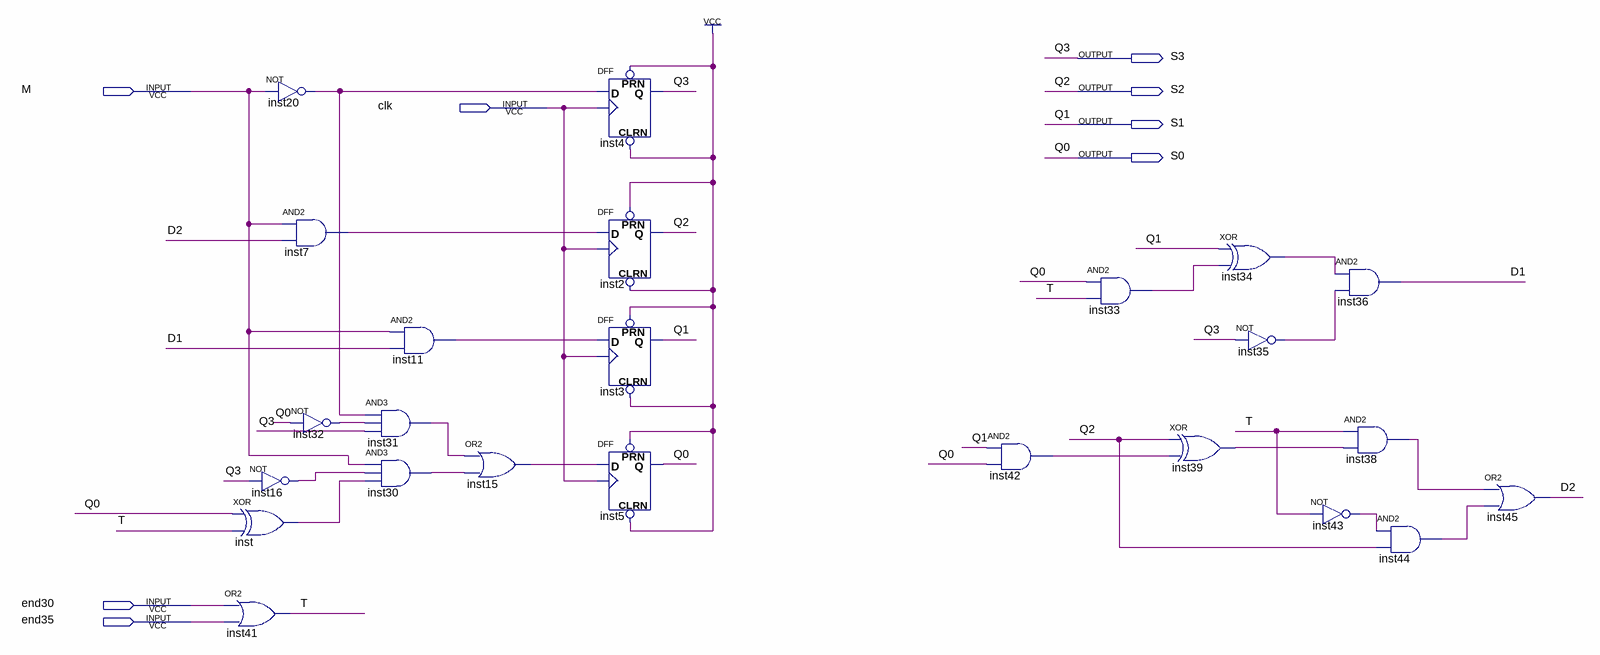
[diagram p0: schematic sheet]
// Quartus schematic MEF_sem.bdf as structural Verilog: 24 symbols, 8 pins
module MEF_sem (
  input  M,
  input  clk,
  input  end30,
  input  end35,
  output S3,
  output S2,
  output S1,
  output S0
);

  wire D1, D2, inst7_out, inst11_out, inst15_out, inst16_out, inst20_out, inst30_out, inst31_out, inst32_out,
       inst33_out, inst34_out, inst35_out, inst38_out, inst39_out, inst42_out, inst43_out, inst44_out,
       inst_out, T;

  or inst41 (T, end30, end35);
  not inst20 (inst20_out, M);
  and inst7 (inst7_out, M, D2);
  not inst32 (inst32_out, S0);
  not inst16 (inst16_out, S3);
  xor inst (inst_out, S0, T);
  and inst11 (inst11_out, M, D1);
  and inst31 (inst31_out, inst20_out, inst32_out, S3);
  and inst30 (inst30_out, M, inst16_out, inst_out);
  or inst15 (inst15_out, inst31_out, inst30_out);
  DFF inst4 (.CLRN(1'b1), .CLK(clk), .D(inst20_out), .PRN(1'b1), .Q(S3));
  DFF inst2 (.CLRN(1'b1), .CLK(clk), .D(inst7_out), .PRN(1'b1), .Q(S2));
  DFF inst3 (.CLRN(1'b1), .CLK(clk), .D(inst11_out), .PRN(1'b1), .Q(S1));
  DFF inst5 (.CLRN(1'b1), .CLK(clk), .D(inst15_out), .PRN(1'b1), .Q(S0));
  and inst42 (inst42_out, S1, S0);
  and inst33 (inst33_out, S0, T);
  xor inst34 (inst34_out, S1, inst33_out);
  xor inst39 (inst39_out, S2, inst42_out);
  not inst35 (inst35_out, S3);
  and inst36 (D1, inst34_out, inst35_out);
  and inst38 (inst38_out, T, inst39_out);
  not inst43 (inst43_out, T);
  and inst44 (inst44_out, inst43_out, S2);
  or inst45 (D2, inst38_out, inst44_out);

  // Other names for the same wires on the sheet: Q0 = S0; Q1 = S1; Q2 = S2; Q3 = S3
endmodule
